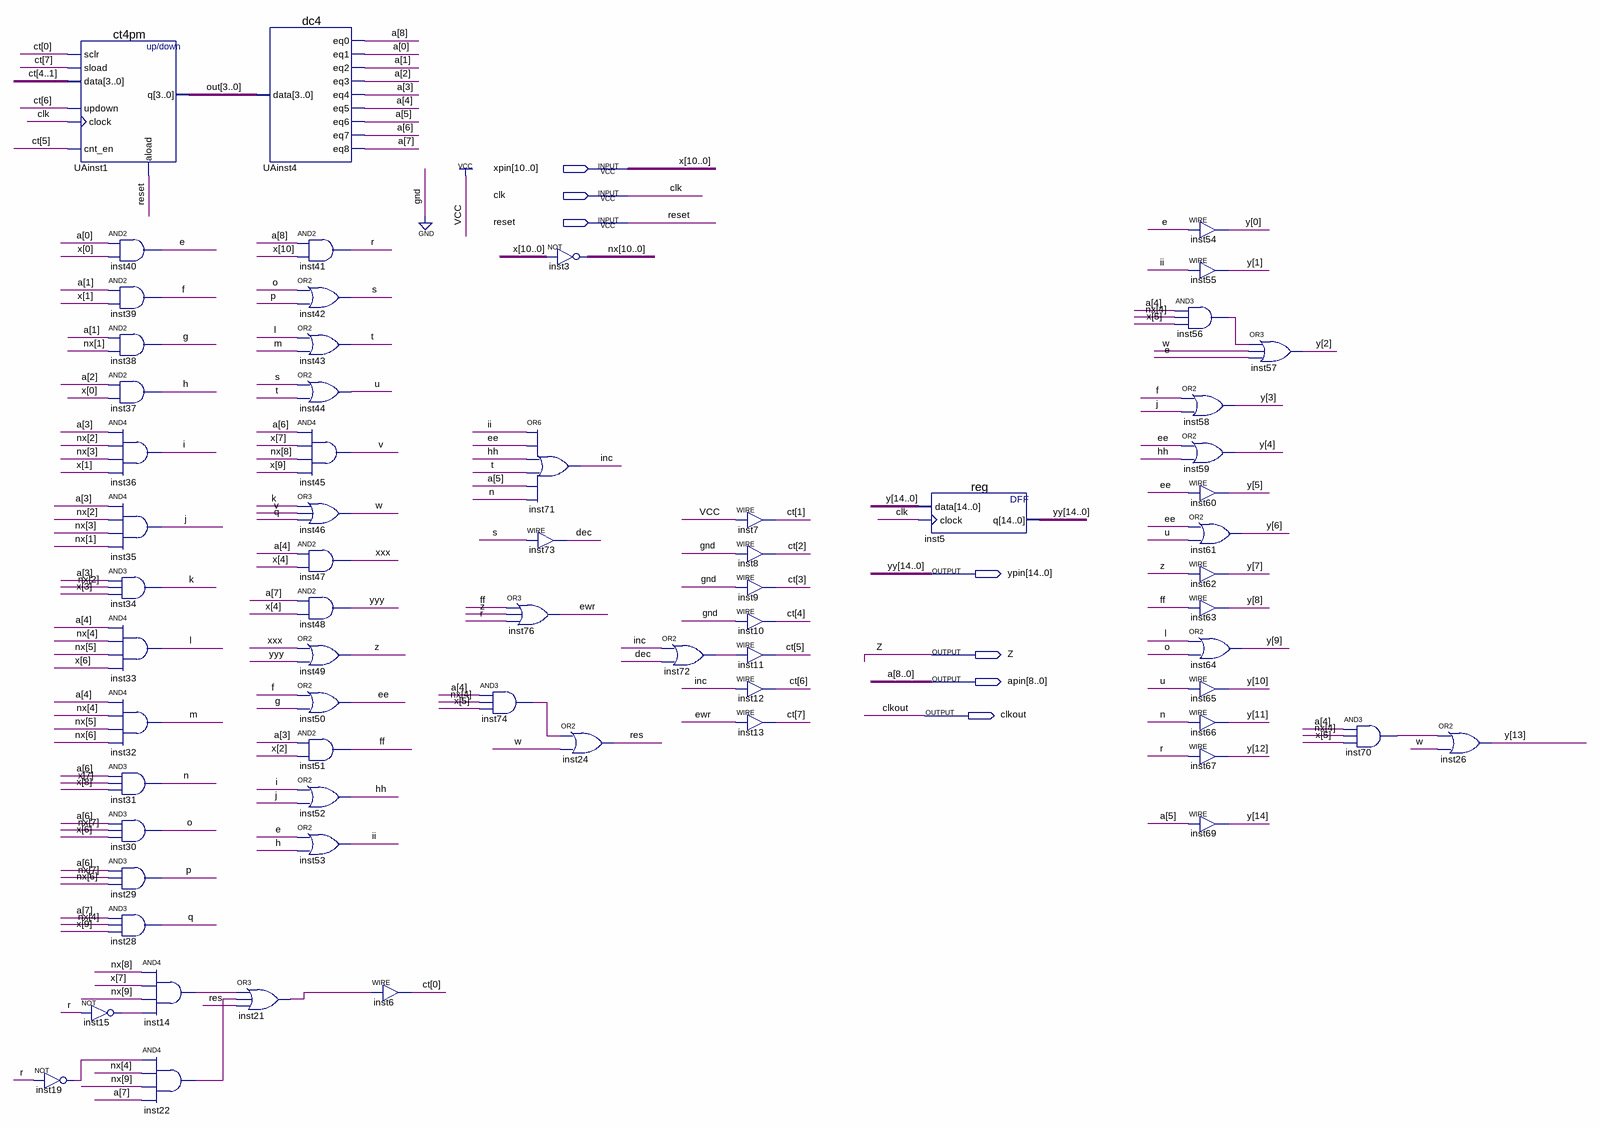
[diagram p0: schematic sheet]
// Quartus schematic UA.bdf as structural Verilog: 66 symbols, 7 pins
module UA (
  input  [10:0] xpin,
  input  clk,
  input  reset,
  output [14:0] ypin,
  output Z,
  output [8:0] apin,
  output clkout
);

  wire dec, e, ee, ewr, f, ff, g, h, hh, i, ii, inc, inst14_out, inst15_out, inst19_out, inst21_out,
       inst22_out, inst56_out, inst70_out, inst72_out, inst74_out, j, k, l, m, n, o, p, q, r, res, s, t, u,
       v, w, xxx, yyy;
  wire [3:0] out;
  wire [7:0] ct;
  wire [10:0] nx;
  wire [14:0] y;

  ct4pm UAinst1 (
    .sclr(ct[0]), .sload(ct[7]), .data(ct[4:1]), .updown(ct[6]), .clock(clk), .cnt_en(ct[5]), .aload(reset),
    .q(out));
  not inst15 (inst15_out, r);
  not inst19 (inst19_out, r);
  and inst40 (e, apin[0], xpin[0]);
  and inst39 (f, apin[1], xpin[1]);
  and inst38 (g, apin[1], nx[1]);
  and inst37 (h, apin[2], xpin[0]);
  and inst36 (i, apin[3], nx[2], nx[3], xpin[1]);
  and inst35 (j, apin[3], nx[2], nx[3], nx[1]);
  and inst34 (k, apin[3], nx[2], xpin[3]);
  and inst33 (l, apin[4], nx[4], nx[5], xpin[6]);
  and inst32 (m, apin[4], nx[4], nx[5], nx[6]);
  and inst31 (n, apin[6], xpin[7], xpin[8]);
  and inst30 (o, apin[6], nx[7], xpin[6]);
  and inst29 (p, apin[6], nx[7], nx[6]);
  and inst28 (q, apin[7], nx[4], xpin[9]);
  and inst14 (inst14_out, nx[8], xpin[7], nx[9], inst15_out);
  and inst22 (inst22_out, inst19_out, nx[4], nx[9], apin[7]);
  or inst21 (inst21_out, inst14_out, inst22_out, res);
  dc4 UAinst4 (
    .data(out), .eq0(apin[8]), .eq1(apin[0]), .eq2(apin[1]), .eq3(apin[2]), .eq4(apin[3]), .eq5(apin[4]),
    .eq6(apin[5]), .eq7(apin[6]), .eq8(apin[7]));
  and inst41 (r, apin[8], xpin[10]);
  or inst42 (s, o, p);
  or inst43 (t, l, m);
  or inst44 (u, s, t);
  and inst45 (v, apin[6], xpin[7], nx[8], xpin[9]);
  or inst46 (w, k, v, q);
  and inst47 (xxx, apin[4], xpin[4]);
  and inst48 (yyy, apin[7], xpin[4]);
  or inst49 (Z, xxx, yyy);
  or inst50 (ee, f, g);
  and inst51 (ff, apin[3], xpin[2]);
  or inst52 (hh, i, j);
  or inst53 (ii, e, h);
  assign ct[0] = inst21_out;  // WIRE inst6
  or inst76 (ewr, ff, Z, r);
  and inst74 (inst74_out, apin[4], nx[4], xpin[5]);
  assign nx = ~xpin;  // NOT inst3, 11 bits wide
  or inst71 (inc, ii, ee, hh, t, apin[5], n);
  assign dec = s;  // WIRE inst73
  or inst24 (res, inst74_out, w);
  or inst72 (inst72_out, inc, dec);
  assign ct[1] = 1'b1;  // WIRE inst7
  assign ct[2] = 1'b0;  // WIRE inst8
  assign ct[3] = 1'b0;  // WIRE inst9
  assign ct[4] = 1'b0;  // WIRE inst10
  assign ct[5] = inst72_out;  // WIRE inst11
  assign ct[6] = inc;  // WIRE inst12
  assign ct[7] = ewr;  // WIRE inst13
  \reg  inst5 (.data(y), .clock(clk), .q(ypin));
  assign y[0] = e;  // WIRE inst54
  assign y[1] = ii;  // WIRE inst55
  and inst56 (inst56_out, apin[4], nx[4], xpin[5]);
  or inst58 (y[3], f, j);
  or inst59 (y[4], ee, hh);
  assign y[5] = ee;  // WIRE inst60
  or inst61 (y[6], ee, u);
  assign y[7] = Z;  // WIRE inst62
  assign y[8] = ff;  // WIRE inst63
  or inst64 (y[9], l, o);
  assign y[10] = u;  // WIRE inst65
  assign y[11] = n;  // WIRE inst66
  assign y[12] = r;  // WIRE inst67
  assign y[14] = apin[5];  // WIRE inst69
  or inst57 (y[2], inst56_out, w, e);
  and inst70 (inst70_out, apin[4], nx[4], xpin[5]);
  or inst26 (y[13], inst70_out, w);

  // Other names for the same wires on the sheet: a[8:0] = apin; x[10:0] = xpin; yy[14:0] = ypin
endmodule
